# EasyEDA Pro project 外接板20260108.eprj, board PCB2
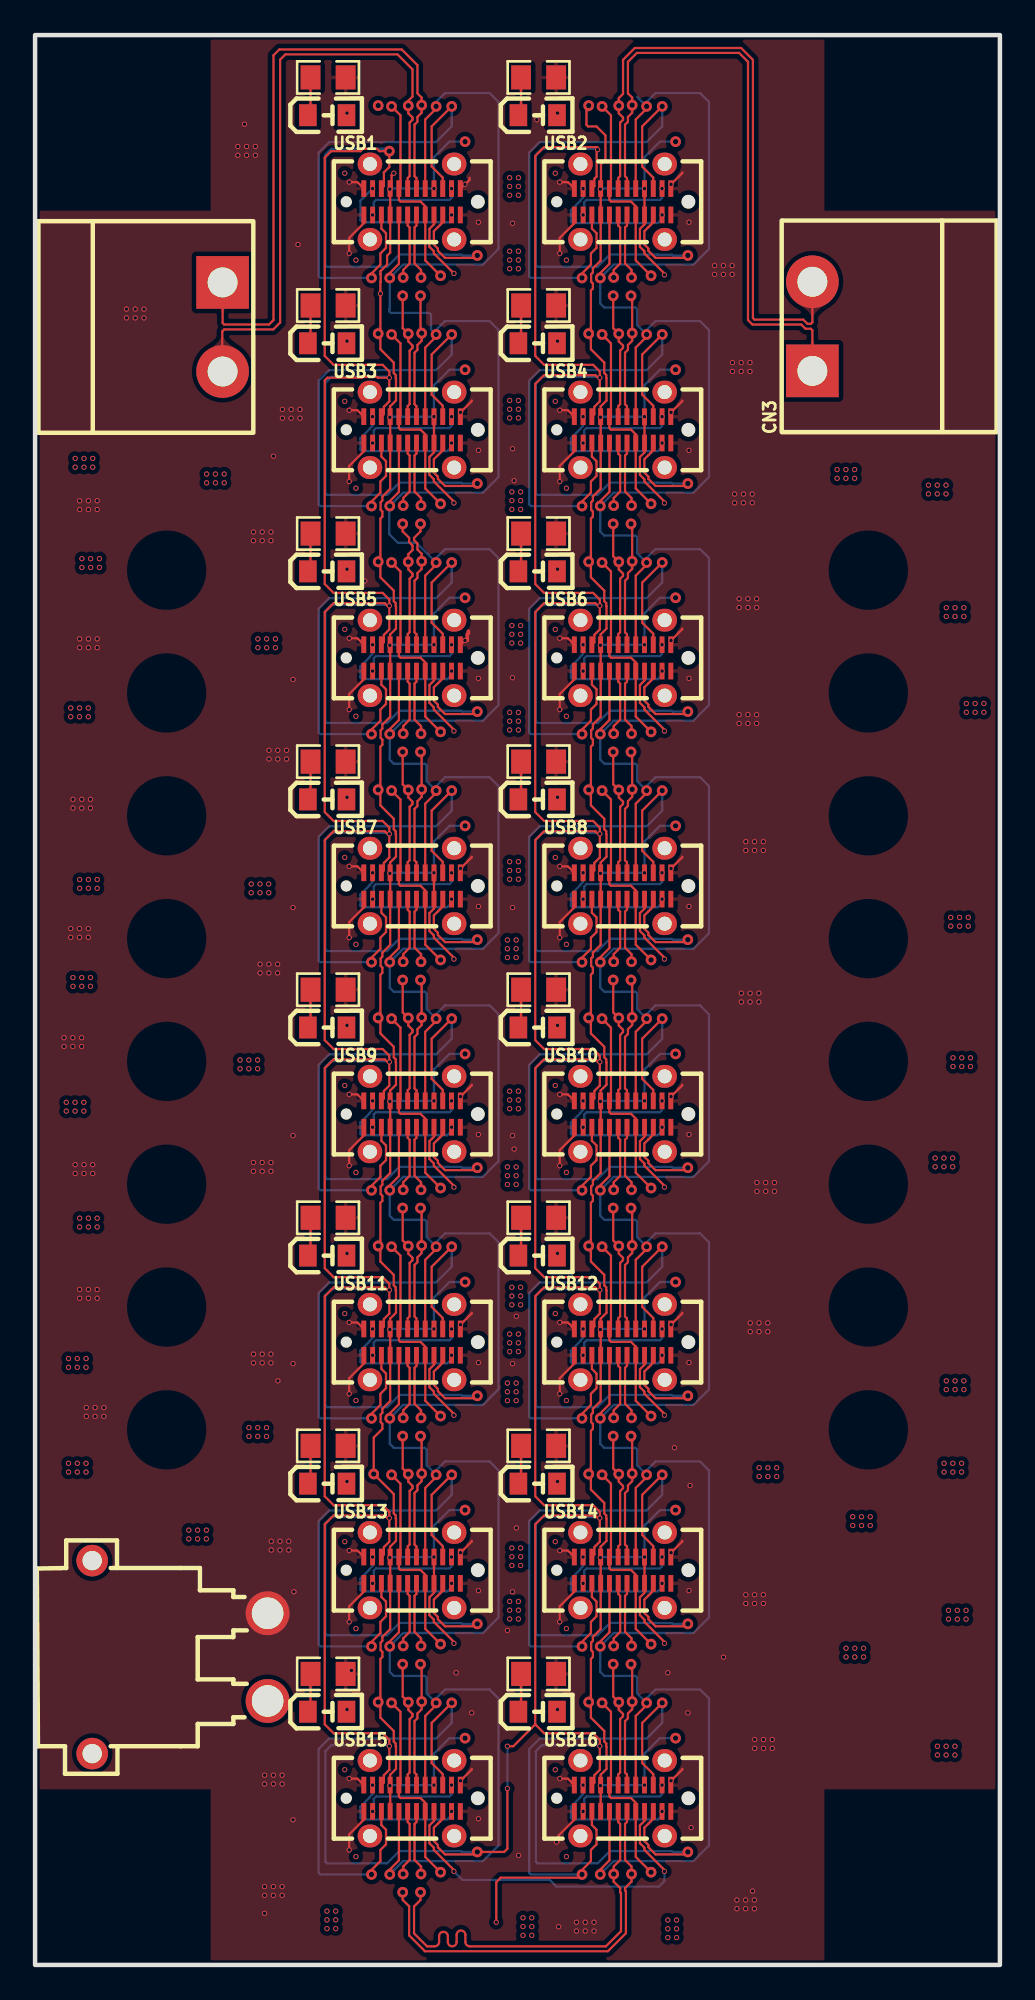
[diagram p1: board, top side]
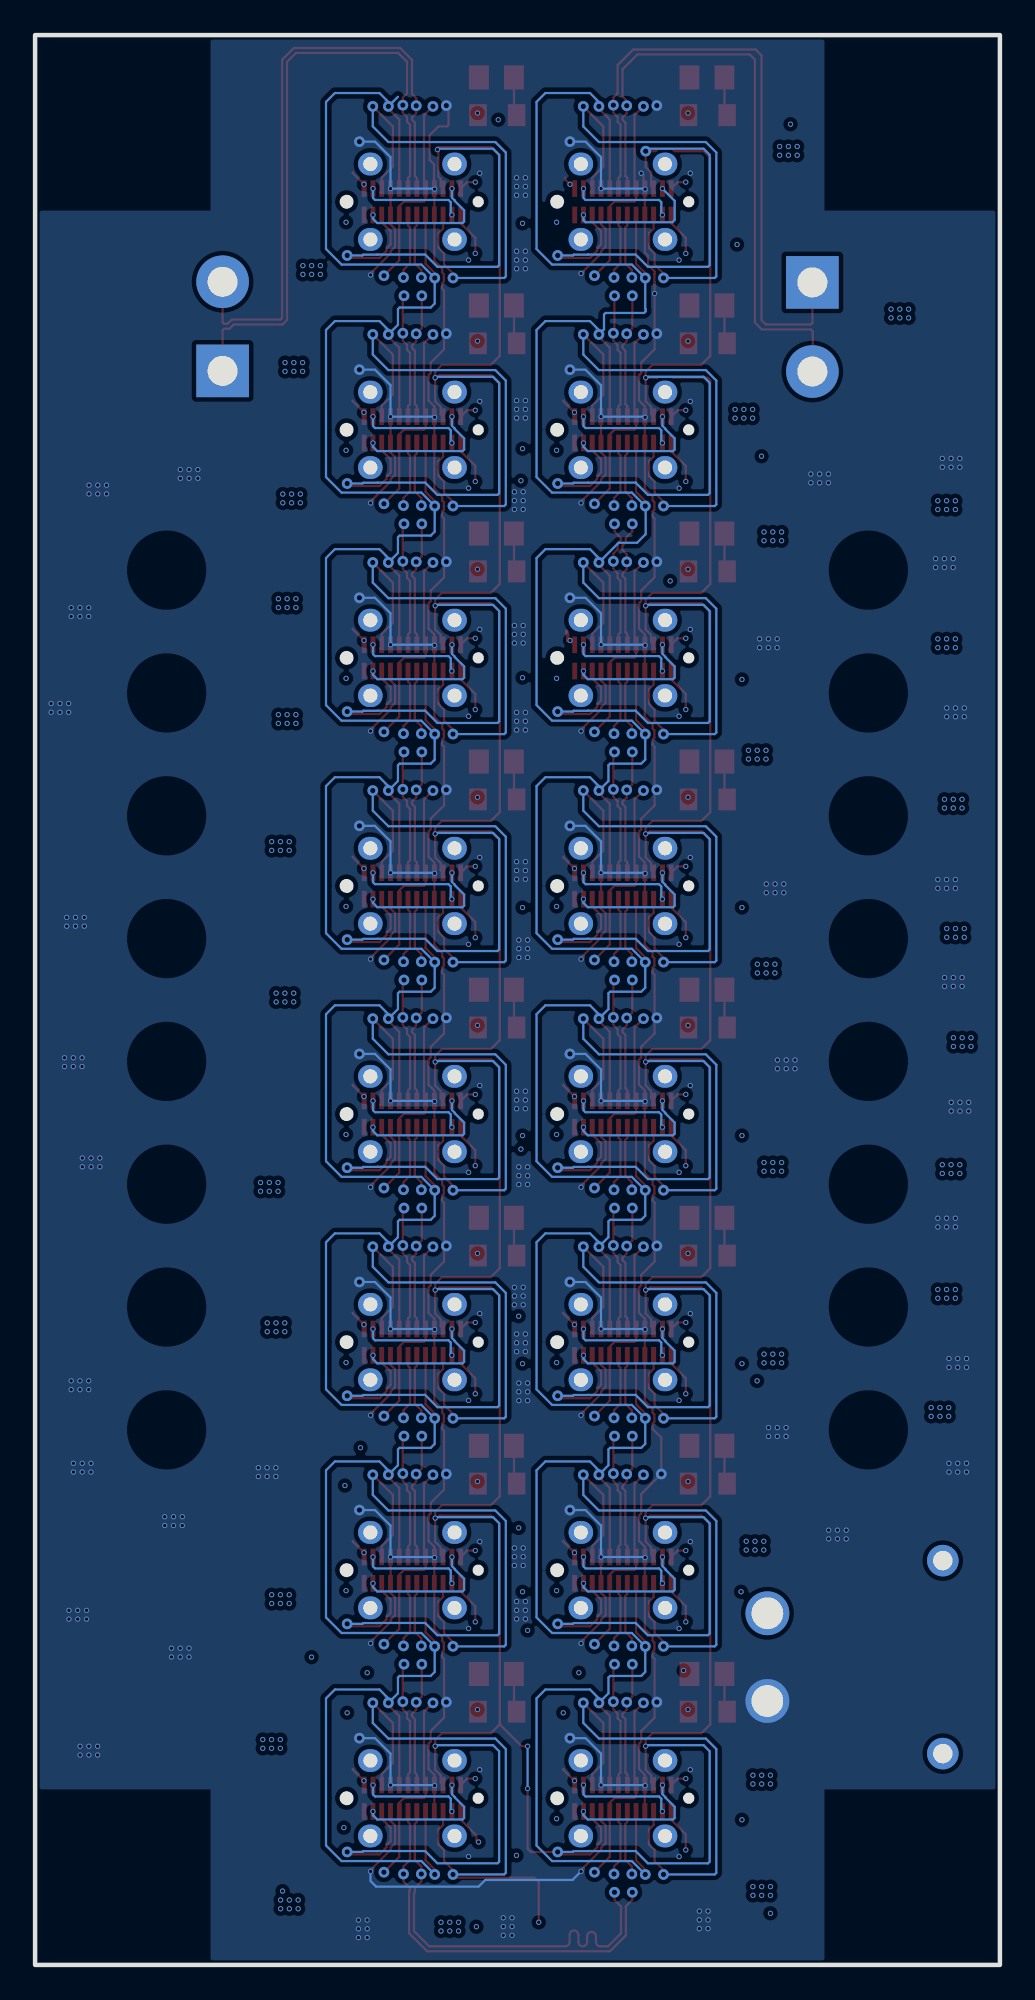
[diagram p2: board, bottom side, seen from below]

Outline 55 x 110 mm; copper layers: Top Layer, Inner1, Inner2, Bottom Layer. Coordinates in mm from the lower left corner of the outline.
Outline path: rectangle 0,110 55,0
Stack: Top Layer 0.035mm 外层铜厚1oz / Dielectric1 0.2104mm 7628 RC49% 8.6mil / Inner1 0.0152mm 内层铜厚 / Dielectric2 1.065mm 1.1mm H/HOZ Copper / Inner2 0.0152mm 内层铜厚 / Dielectric3 0.2104mm 7628 RC49% 8.6mil / Bottom Layer 0.035mm 外层铜厚1oz

## Design rules (mm)
net CAN_H: DP1
net CAN_L: DP1
template: 自定义配置
spacing copperThickness1oz (default): track to track 0.102, other pairs 0.152 to 0.3
spacing copperThickness2oz: track to track 0.203, other pairs 0.152 to 0.3
track width copperThickness1oz (default): min 0.127, default 0.127, max 2.54
track width copperThickness2oz: min 0.203, default 0.254, max 2.54
differential pair differentialPair (default): width min 0.127, default 0.254, max 2.54; gap min 0.152, default 0.152
via viaSize: diameter min 0.5, default 0.61, max 10; hole min 0.3, default 0.305, max 6.3
via viaSize1 (default): diameter min 0.25, default 0.3, max 10; hole min 0.15, default 0.2, max 6.3

## Placement (name value [footprint] x y rotation side)
CN1  XT30PW-M30.G.Y  [CONN-TH_XT30PW-M]  8.25 17.54 270 top
CN2  WJ2EDGRC-5.08-2P  [CONN-TH_2P-P5.08_WJ2EDGRC-5.08-2P]  10.69 93.36 270 top
CN3  WJ2EDGRC-5.08-2P  [CONN-TH_2P-P5.08_WJ2EDGRC-5.08-2P]  44.31 93.4 90 top
LED1  -  [LED_0805]  16.7 105.43 0 top
LED2  -  [LED_0805]  28.7 105.43 0 top
LED3  -  [LED_0805]  16.7 92.43 0 top
LED4  -  [LED_0805]  28.7 92.43 0 top
LED5  -  [LED_0805]  16.7 79.43 0 top
LED6  -  [LED_0805]  28.7 79.43 0 top
LED7  -  [LED_0805]  16.7 66.43 0 top
LED8  -  [LED_0805]  28.7 66.43 0 top
LED9  -  [LED_0805]  16.7 53.43 0 top
LED10  -  [LED_0805]  28.7 53.43 0 top
LED11  -  [LED_0805]  16.7 40.43 0 top
LED12  -  [LED_0805]  28.7 40.43 0 top
LED13  -  [LED_0805]  16.7 27.43 0 top
LED14  -  [LED_0805]  28.7 27.43 0 top
LED15  -  [LED_0805]  16.7 14.43 0 top
LED16  -  [LED_0805]  28.7 14.43 0 top
R1  1K  [R0805]  16.7 107.59 0 top
R2  1K  [R0805]  28.7 107.59 0 top
R3  1K  [R0805]  16.7 94.59 0 top
R4  1K  [R0805]  28.7 94.59 0 top
R5  1K  [R0805]  16.7 81.59 0 top
R6  1K  [R0805]  28.7 81.59 0 top
R7  1K  [R0805]  16.7 68.59 0 top
R8  1K  [R0805]  28.7 68.59 0 top
R9  1K  [R0805]  16.7 55.59 0 top
R10  1K  [R0805]  28.7 55.59 0 top
R11  1K  [R0805]  16.7 42.59 0 top
R12  1K  [R0805]  28.7 42.59 0 top
R13  1K  [R0805]  16.7 29.59 0 top
R14  1K  [R0805]  28.7 29.59 0 top
R15  1K  [R0805]  16.7 16.59 0 top
R16  1K  [R0805]  28.7 16.59 0 top
USB1  MC-236LS-L64  [TYPE-C-USB-SMD_TYPE-C-31-M-06]  21.49 100.5 0 top
USB2  MC-236LS-L64  [TYPE-C-USB-SMD_TYPE-C-31-M-06]  33.49 100.5 0 top
USB3  MC-236LS-L64  [TYPE-C-USB-SMD_TYPE-C-31-M-06]  21.49 87.5 0 top
USB4  MC-236LS-L64  [TYPE-C-USB-SMD_TYPE-C-31-M-06]  33.49 87.5 0 top
USB5  MC-236LS-L64  [TYPE-C-USB-SMD_TYPE-C-31-M-06]  21.49 74.5 0 top
USB6  MC-236LS-L64  [TYPE-C-USB-SMD_TYPE-C-31-M-06]  33.49 74.5 0 top
USB7  MC-236LS-L64  [TYPE-C-USB-SMD_TYPE-C-31-M-06]  21.49 61.5 0 top
USB8  MC-236LS-L64  [TYPE-C-USB-SMD_TYPE-C-31-M-06]  33.49 61.5 0 top
USB9  MC-236LS-L64  [TYPE-C-USB-SMD_TYPE-C-31-M-06]  21.49 48.5 0 top
USB10  MC-236LS-L64  [TYPE-C-USB-SMD_TYPE-C-31-M-06]  33.49 48.5 0 top
USB11  MC-236LS-L64  [TYPE-C-USB-SMD_TYPE-C-31-M-06]  21.49 35.5 0 top
USB12  MC-236LS-L64  [TYPE-C-USB-SMD_TYPE-C-31-M-06]  33.49 35.5 0 top
USB13  MC-236LS-L64  [TYPE-C-USB-SMD_TYPE-C-31-M-06]  21.49 22.5 0 top
USB14  MC-236LS-L64  [TYPE-C-USB-SMD_TYPE-C-31-M-06]  33.49 22.5 0 top
USB15  MC-236LS-L64  [TYPE-C-USB-SMD_TYPE-C-31-M-06]  21.49 9.5 0 top
USB16  MC-236LS-L64  [TYPE-C-USB-SMD_TYPE-C-31-M-06]  33.49 9.5 0 top

## Footprints (pads in the part's own frame, mm; a bottom-side part is the same pattern mirrored in y, then rotated)
CONN-TH_2P-P5.08_WJ2EDGRC-5.08-2P
  rect 3x3 hole 1.7: 1(-2.54,0)
  round 3 hole 1.7: 2(2.54,0)
CONN-TH_XT30PW-M
  round 2.5 hole 1.8: 1(-2.5,5) 2(2.5,5)
  round 1.8 hole 1.1: 3(5.5,-5) 4(-5.5,-5)
LED_0805
  rect 1x1.25 smd: 1(-1.15,0.005) 2(1.05,0.005)
R0805
  rect 1.133x1.377 smd: 1(-1,0) 2(1,0)
TYPE-C-USB-SMD_TYPE-C-31-M-06
  oval 1.4x1.3 hole 0.8: 25(-2.401,2.15) 25(-2.401,-2.15) 25(2.399,2.15) 25(2.399,-2.15)
  rect 0.28x0.95 smd: A1(-2.751,0.75) A2(-2.251,0.75) A3(-1.751,0.75) A4(-1.251,0.75) A5(-0.751,0.75) A6(-0.251,0.75) A7(0.249,0.75) A8(0.749,0.75) A9(1.249,0.75) A10(1.749,0.75) A11(2.249,0.75) A12(2.749,0.75) B1(2.751,-0.751) B2(2.251,-0.751) B3(1.751,-0.751) B4(1.251,-0.751) B5(0.751,-0.751) B6(0.251,-0.751) B7(-0.249,-0.751) B8(-0.749,-0.751) B9(-1.249,-0.751) B10(-1.749,-0.751) B11(-2.249,-0.751) B12(-2.749,-0.751)

## Nets
As in the schematic.

Pads without a net: CN1 3 4; USB1 25; USB2 25; USB3 25; USB4 25; USB5 25; USB6 25; USB7 25; USB8 25; USB9 25; USB10 25; USB11 25; USB12 25; USB13 25; USB14 25; USB15 25; USB16 25

## Via types
v1: diameter 0.3, hole 0.2, Top Layer to Bottom Layer, 754 vias
v2: diameter 0.61, hole 0.305, Top Layer to Bottom Layer, 239 vias

## Routing (per net, layer and track width the routed paths; a pad name or vN(x,y) marks a point on that pad's centre or on a via; arc(x,y) is an arc through that point)
GND: length 185.2
  Top Layer w0.127: v1(17.91,62.62) 18.37,62.62 USB7.A1 ; v1(17.91,45.55) 17.91,46.44 18.74,47.28 USB9.B12 ; USB16.A1 30.37,10.62 v1(29.91,10.62) ; USB4.B12 30.74,86.28 29.91,85.44 v1(29.91,84.55) ; 24.89,37.17 24.89,37.14 v1(24.25,36.5) ; v1(36.25,10.5) 36.89,11.13 36.89,11.17 ; v1(24.25,23.5) 24.89,24.13 24.89,24.17 ; USB12.B12 30.74,34.28 29.91,33.44 v1(29.91,32.55) ; v1(36.25,23.5) 36.89,24.13 36.89,24.17 ; v1(17.91,101.62) 18.37,101.62 USB1.A1 ; USB15.B12 18.74,8.28 17.91,7.44 v1(17.91,6.55) ; 36.89,63.17 36.89,63.14 v1(36.25,62.5) ; 24.89,63.17 24.89,63.14 v1(24.25,62.5) ; 24.89,89.17 24.89,89.14 v1(24.25,88.5) ; v1(24.25,10.5) 24.89,11.13 24.89,11.17 ; v1(29.91,88.62) 30.37,88.62 USB4.A1 ; v1(24.25,49.5) 24.89,50.14 24.89,50.17 ; v1(17.91,49.62) 18.37,49.62 USB9.A1 ; USB6.B12 30.74,73.28 29.91,72.44 v1(29.91,71.55) ; 36.89,37.17 36.89,37.14 v1(36.25,36.5) ; 36.89,76.17 36.89,76.14 v1(36.25,75.5) ; USB3.B12 18.74,86.28 17.91,85.44 v1(17.91,84.55) ; USB10.A1 30.37,49.62 v1(29.91,49.62) ; v1(17.91,10.62) 18.37,10.62 USB15.A1 ; USB5.A12 24.26,75.25 v1(24.51,75.5) ; v1(29.91,101.62) 30.37,101.62 USB2.A1 ; v1(17.91,58.55) 17.91,59.44 18.74,60.28 USB7.B12 ; USB1.B12 18.74,99.28 17.91,98.44 v1(17.91,97.55) ; v1(29.91,75.62) 30.37,75.62 USB6.A1 ; v1(29.91,62.62) 30.37,62.62 USB8.A1 ; USB16.B12 30.74,8.28 29.84,7.38 29.84,7 ; USB12.A1 30.37,36.62 v1(29.91,36.62) ; v1(17.91,88.62) 18.37,88.62 USB3.A1 ; 36.89,89.17 36.89,89.14 v1(36.25,88.5) ; 36.89,50.17 36.89,50.14 v1(36.25,49.5) ; USB2.B12 30.74,99.28 29.91,98.44 v1(29.91,97.55) ; v1(29.91,19.55) 29.91,20.44 30.74,21.28 USB14.B12 ; v1(17.91,36.62) 18.37,36.62 USB11.A1 ; USB14.A1 30.37,23.62 v1(29.91,23.62) ; USB13.B12 18.74,21.28 17.91,20.44 v1(17.91,19.55) ; USB1.A12 24.48,101.5 v1(24.51,101.5) 24.52,101.5 24.76,101.75 24.76,101.87 ; USB11.B12 18.74,34.28 17.91,33.44 v1(17.91,32.55) ; 36.89,102.17 36.89,102.13 v1(36.25,101.5) ; v1(17.91,23.62) 18.37,23.62 USB13.A1 ; USB5.B12 18.74,73.28 17.91,72.44 v1(17.91,71.55) ; v1(29.91,45.55) 29.91,46.44 30.74,47.28 USB10.B12 ; v1(29.91,58.55) 29.91,59.44 30.74,60.28 USB8.B12 ; USB5.A1 18.37,75.62 v1(17.91,75.62)
  Top Layer w0.2: 24.7,76.03 24.7,75.9 24.64,75.84 24.64,75.5 24.63,75.5 v1(24.51,75.5)
  Inner2 w0.127: v1(29.91,58.55) 29.27,58.55 28.76,59.06 28.76,60.34 ; v1(17.91,32.55) 17.27,32.55 16.76,33.06 16.76,34.34 ; 16.76,8.34 16.76,9.47 v1(17.91,10.62) ; 16.76,8.34 16.7,8.27 v1(14.71,8.27) ; 16.76,8.34 16.76,7.06 17.27,6.55 v1(17.91,6.55) ; v1(27.21,86.43) 28.7,86.43 28.76,86.49 ; 28.76,34.34 28.76,35.47 v1(29.91,36.62) ; 28.76,34.34 28.76,33.06 29.27,32.55 v1(29.91,32.55) ; 28.76,34.34 28.7,34.27 v1(27.21,34.27) ; 16.76,98.06 16.76,100.47 v1(17.91,101.62) ; 16.76,98.06 v1(14.99,98.06) ; 16.76,98.06 17.27,97.55 v1(17.91,97.55) ; 28.76,73.44 28.7,73.37 v1(27.21,73.37) ; 16.76,34.34 16.7,34.27 v1(14.71,34.27) ; 16.76,34.34 16.76,35.47 v1(17.91,36.62) ; 16.76,85.99 16.76,87.47 v1(17.91,88.62) ; 16.76,85.99 16.76,85.06 17.27,84.55 v1(17.91,84.55) ; 16.76,85.99 16.75,86 v1(13.59,86) ; v1(17.91,71.55) 17.27,71.55 16.76,72.06 16.76,73.34 ; v1(29.91,23.62) 28.76,22.47 28.76,21.34 ; v1(29.91,88.62) 28.76,87.47 28.76,86.49 ; 16.76,21.29 16.75,21.27 v1(14.76,21.27) ; 16.76,21.29 16.76,22.47 v1(17.91,23.62) ; 16.76,21.29 16.76,20.06 17.27,19.55 v1(17.91,19.55) ; v1(29.91,19.55) 29.27,19.55 28.76,20.06 28.76,21.34 ; 16.76,47.34 16.76,46.06 17.27,45.55 v1(17.91,45.55) ; 16.76,47.34 16.76,48.47 v1(17.91,49.62) ; 16.76,47.34 16.7,47.27 v1(14.71,47.27) ; v1(27.21,60.27) 28.7,60.27 28.76,60.34 ; v1(27.21,47.27) 28.7,47.27 28.76,47.34 ; v1(29.91,75.62) 28.76,74.47 28.76,72.06 29.27,71.55 v1(29.91,71.55) ; v1(17.91,75.62) 16.76,74.47 16.76,73.34 ; v1(29.91,62.62) 28.76,61.47 28.76,60.34 ; 28.76,21.34 28.7,21.27 v1(27.21,21.27) ; 16.76,73.34 16.7,73.27 v1(14.71,73.27) ; v1(29.91,49.62) 28.76,48.47 28.76,46.06 29.27,45.55 v1(29.91,45.55) ; v1(27.21,99.27) 28.7,99.27 28.76,99.34 ; v1(29.91,84.55) 29.27,84.55 28.76,85.06 28.76,86.49 ; v1(17.91,58.55) 17.27,58.55 16.76,59.06 16.76,60.34 ; v1(14.71,60.27) 16.7,60.27 16.76,60.34 ; v1(29.91,97.55) 29.27,97.55 28.76,98.06 28.76,100.47 v1(29.91,101.62) ; 16.76,60.34 16.76,61.47 v1(17.91,62.62) ; v1(29.72,7) 29.66,7.06 28.89,7.06 28.76,7.19 28.76,9.47 v1(29.91,10.62)
  vias: v1(1.65,52.85) v1(1.65,52.35) v1(2.03,59.07) v1(2.03,58.57) v1(2.16,66.44) v1(2.16,65.94) v1(2.15,52.85) v1(2.15,52.35) v1(2.29,45.61) v1(2.29,45.11) v1(2.54,83.46) v1(2.54,82.96) v1(2.54,75.58) v1(2.54,75.08) v1(2.53,59.07) v1(2.53,58.57) v1(2.54,38.5) v1(2.54,38) v1(2.66,66.44) v1(2.66,65.94) v1(2.65,52.85) v1(2.65,52.35) v1(2.79,45.61) v1(2.79,45.11) v1(2.92,31.77) v1(2.92,31.27) v1(3.04,83.46) v1(3.04,82.96) v1(3.04,75.58) v1(3.04,75.08) v1(3.03,59.07) v1(3.03,58.57) v1(3.04,38.5) v1(3.04,38) v1(3.16,66.44) v1(3.16,65.94) v1(3.29,45.61) v1(3.29,45.11) v1(3.42,31.77) v1(3.42,31.27) v1(3.54,83.46) v1(3.54,82.96) v1(3.54,75.58) v1(3.54,75.08) v1(3.54,38.5) v1(3.54,38) v1(3.92,31.77) v1(3.92,31.27) v1(5.21,94.38) v1(5.21,93.88) v1(5.71,94.38) v1(5.71,93.88) v1(6.21,94.38) v1(6.21,93.88) v1(11.56,103.65) v1(11.56,103.15) v1(11.94,104.92) v1(12.06,103.65) v1(12.06,103.15) v1(12.45,81.68) v1(12.45,81.18) v1(12.45,45.74) v1(12.45,45.24) v1(12.45,34.82) v1(12.45,34.32) v1(12.56,103.65) v1(12.56,103.15) v1(12.83,57.04) v1(12.83,56.54) v1(12.95,81.68) v1(12.95,81.18) v1(12.95,45.74) v1(12.95,45.24) v1(12.95,34.82) v1(12.95,34.32) v1(13.08,10.81) v1(13.08,10.31) v1(13.08,4.46) v1(13.08,3.96) v1(13.08,2.94) v1(13.34,69.23) v1(13.34,68.73) v1(13.33,57.04) v1(13.33,56.54) v1(13.45,81.68) v1(13.45,81.18) v1(13.45,45.74) v1(13.45,45.24) v1(13.45,34.82) v1(13.45,34.32) v1(13.46,24.15) v1(13.46,23.65) v1(13.58,10.81) v1(13.58,10.31) v1(13.58,4.46) v1(13.58,3.96) v1(13.84,69.23) v1(13.84,68.73) v1(13.83,57.04) v1(13.83,56.54) v1(13.84,33.29) v1(13.96,24.15) v1(13.96,23.65) v1(14.1,88.66) v1(14.1,88.16) v1(14.08,10.81) v1(14.08,10.31) v1(14.08,4.46) v1(14.08,3.96) v1(14.34,69.23) v1(14.34,68.73) v1(14.46,24.15) v1(14.46,23.65) v1(14.6,88.66) v1(14.6,88.16) v1(15.1,88.66) v1(15.1,88.16) v1(18.03,16.78) v1(18.8,78.89) v1(24,16.66) v1(24.89,14.37) v1(25.27,99.33) v1(25.27,86.33) v1(25.27,73.33) v1(25.27,60.33) v1(25.27,47.33) v1(25.27,34.33) v1(25.27,21.33) v1(25.27,8.33) v1(26.92,19.07) v1(27.31,84.6) v1(27.31,46.5) v1(27.43,36.97) v1(27.43,24.91) v1(27.56,6.24) v1(28.6,105.17) v1(29.84,2.18) v1(30.86,2.43) v1(30.86,1.93) v1(31.36,2.43) v1(31.36,1.93) v1(31.86,2.43) v1(31.86,1.93) v1(36.07,16.66) v1(36.45,29.48) v1(37.21,14.37) v1(37.27,99.33) v1(37.27,86.33) v1(37.27,73.33) v1(37.27,60.33) v1(37.27,47.33) v1(37.27,34.33) v1(37.34,27.32) v1(37.27,21.33) v1(37.4,7.82) v1(38.74,96.86) v1(38.74,96.36) v1(39.24,96.86) v1(39.24,96.36) v1(39.24,17.54) v1(39.74,96.86) v1(39.74,96.36) v1(39.75,91.33) v1(39.75,90.83) v1(39.88,83.84) v1(39.88,83.34) v1(40,3.7) v1(40,3.2) v1(40.13,77.87) v1(40.13,77.37) v1(40.13,71.27) v1(40.13,70.77) v1(40.25,91.33) v1(40.25,90.83) v1(40.26,55.39) v1(40.26,54.89) v1(40.38,83.84) v1(40.38,83.34) v1(40.51,64.03) v1(40.51,63.53) v1(40.51,21.1) v1(40.51,20.6) v1(40.5,3.7) v1(40.5,3.2) v1(40.63,77.87) v1(40.63,77.37) v1(40.63,71.27) v1(40.63,70.77) v1(40.75,91.33) v1(40.75,90.83) v1(40.76,55.39) v1(40.76,54.89) v1(40.77,36.59) v1(40.77,36.09) v1(40.88,83.84) v1(40.88,83.34) v1(40.89,4.21) v1(41.01,64.03) v1(41.01,63.53) v1(41.01,21.1) v1(41.01,20.6) v1(41.02,12.84) v1(41.02,12.34) v1(41,3.7) v1(41,3.2) v1(41.13,77.87) v1(41.13,77.37) v1(41.13,71.27) v1(41.13,70.77) v1(41.15,44.59) v1(41.15,44.09) v1(41.26,55.39) v1(41.26,54.89) v1(41.27,36.59) v1(41.27,36.09) v1(41.51,64.03) v1(41.51,63.53) v1(41.51,21.1) v1(41.51,20.6) v1(41.52,12.84) v1(41.52,12.34) v1(41.65,44.59) v1(41.65,44.09) v1(41.77,36.59) v1(41.77,36.09) v1(42.02,12.84) v1(42.02,12.34) v1(42.15,44.59) v1(42.15,44.09)
VCC3_3V: length 581.9
  Top Layer w0.127: v2(19.18,83.16) 19.18,83.41 19.69,83.92 19.69,84.55 20,84.87 20,85.71 19.74,85.97 USB3.B10 ; v2(31.18,96.16) 31.18,96.41 31.69,96.92 31.69,97.55 32,97.87 32,98.71 31.74,98.97 USB2.B10 ; v2(35.75,14.94) 34.61,13.79 34.61,11.51 35.24,10.87 USB16.A10 ; USB12.B10 31.74,33.97 32,33.71 32,32.87 31.69,32.55 31.69,31.92 31.18,31.41 v2(31.18,31.16) ; USB7.B10 19.74,59.97 20,59.71 20,58.87 19.69,58.55 19.69,57.92 19.18,57.41 v2(19.18,57.16) ; v2(19.18,31.16) 19.18,31.41 19.69,31.92 19.69,32.55 20,32.87 20,33.71 19.74,33.97 USB11.B10 ; v2(19.18,5.16) 19.18,5.41 19.69,5.92 19.69,6.55 20,6.87 20,7.71 19.74,7.97 USB15.B10 ; USB1.A10 23.24,101.87 22.61,102.51 22.61,104.79 v2(23.75,105.94) ; USB13.B10 19.74,20.97 20,20.71 20,19.87 19.69,19.55 19.69,18.92 19.18,18.41 v2(19.18,18.16) ; v2(23.75,40.94) 22.61,39.79 22.61,37.51 23.24,36.87 USB11.A10 ; v2(35.75,53.94) 34.61,52.79 34.61,50.51 35.24,49.87 USB10.A10 ; v2(23.75,66.94) 22.61,65.79 22.61,63.51 23.24,62.87 USB7.A10 ; v2(35.75,92.94) 34.61,91.79 34.61,89.51 35.24,88.87 USB4.A10 ; USB5.B10 19.74,72.97 20,72.71 20,71.87 19.69,71.55 19.69,70.92 19.18,70.41 v2(19.18,70.16) ; USB3.A10 23.24,88.87 22.61,89.51 22.61,91.79 v2(23.75,92.94) ; USB14.B10 31.74,20.97 32,20.71 32,19.87 31.69,19.55 31.69,18.92 31.18,18.41 v2(31.18,18.16) ; USB4.B10 31.74,85.97 32,85.71 32,84.87 31.69,84.55 31.69,83.92 31.18,83.41 v2(31.18,83.16) ; USB15.A10 23.24,10.87 22.61,11.51 22.61,13.79 v2(23.75,14.94) ; USB2.A10 35.24,101.87 34.61,102.51 34.61,104.79 v2(35.75,105.94) ; v2(23.75,53.94) 22.61,52.79 22.61,50.51 23.24,49.87 USB9.A10 ; v2(31.18,70.16) 31.18,70.41 31.69,70.92 31.69,71.55 32,71.87 32,72.71 31.74,72.97 USB6.B10 ; USB5.A10 23.24,75.87 22.61,76.51 22.61,78.79 v2(23.75,79.94) ; USB1.B10 19.74,98.97 20,98.71 20,97.87 19.69,97.55 19.69,96.92 19.18,96.41 v2(19.18,96.16) ; v2(31.18,57.16) 31.18,57.41 31.69,57.92 31.69,58.55 32,58.87 32,59.71 31.74,59.97 USB8.B10 ; USB16.B10 31.74,7.97 32,7.71 32,6.87 31.69,6.55 31.69,5.92 31.18,5.41 v2(31.18,5.16) 30.99,4.97 26.54,4.97 26.29,4.72 v1(26.29,2.43) ; USB12.A10 35.24,36.87 34.61,37.51 34.61,39.79 v2(35.75,40.94) ; USB14.A10 35.24,23.87 34.61,24.51 34.61,26.79 v2(35.75,27.94) ; USB8.A10 35.24,62.87 34.61,63.51 34.61,65.79 v2(35.75,66.94) ; USB10.B10 31.74,46.97 32,46.71 32,45.87 31.69,45.55 31.69,44.92 31.18,44.41 v2(31.18,44.16) ; USB9.B10 19.74,46.97 20,46.71 20,45.87 19.69,45.55 19.69,44.92 19.18,44.41 v2(19.18,44.16) ; USB13.A10 23.24,23.87 22.61,24.51 22.61,26.79 v2(23.75,27.94) ; USB6.A10 35.24,75.87 34.61,76.51 34.61,78.79 v2(35.75,79.94)
  Inner1 w0.127: v1(26.29,2.43) 19.69,2.43 19.18,2.94 v2(19.18,5.16) ; v2(31.18,31.16) 31.18,29.47 31.43,29.22 35.24,29.22 35.75,28.71 v2(35.75,27.94) ; v2(31.18,18.16) 31.18,16.47 31.43,16.22 35.24,16.22 35.75,15.71 v2(35.75,14.94) ; v2(19.18,96.16) 19.18,94.51 19.56,94.12 22.73,94.12 23.75,93.11 v2(23.75,92.94) ; v2(35.75,92.94) 35.75,93.71 35.24,94.22 31.43,94.22 31.18,94.47 v2(31.18,96.16) ; v2(35.75,79.94) 35.75,80.71 35.24,81.22 31.43,81.22 31.18,81.47 v2(31.18,83.16) ; v2(19.18,70.16) 19.18,68.47 19.43,68.22 23.24,68.22 23.75,67.71 v2(23.75,66.94) ; v2(23.75,27.94) 23.75,28.71 23.24,29.22 19.43,29.22 19.18,29.47 v2(19.18,31.16) ; v2(35.75,66.94) 35.75,67.71 35.24,68.22 31.43,68.22 31.18,68.47 v2(31.18,70.16) ; v2(19.18,44.16) 19.18,42.47 19.43,42.22 23.24,42.22 23.75,41.71 v2(23.75,40.94) ; v2(23.75,53.94) 23.75,54.71 23.24,55.22 19.43,55.22 19.18,55.47 v2(19.18,57.16) ; v2(35.75,53.94) 35.75,54.71 35.24,55.22 31.43,55.22 31.18,55.47 v2(31.18,57.16) ; v2(23.75,79.94) 23.46,80.23 23.46,81.08 23.37,81.17 19.69,81.17 19.18,81.68 v2(19.18,83.16) ; v2(35.75,40.94) 35.75,41.71 35.24,42.22 31.43,42.22 31.18,42.47 v2(31.18,44.16) ; v2(19.18,18.16) 19.18,16.47 19.43,16.22 23.24,16.22 23.75,15.71 v2(23.75,14.94)
  Bottom Layer w0.127: v2(19.18,18.16) 16.26,18.16 16.17,18.25 16.17,25.31 16.76,25.9 22.86,25.9 23.75,26.79 v2(23.75,27.94) ; v2(19.18,31.16) 16.26,31.16 16.17,31.25 16.17,38.31 16.76,38.9 22.86,38.9 23.75,39.79 v2(23.75,40.94) ; v2(35.75,79.94) 35.75,78.79 34.86,77.9 28.76,77.9 28.17,77.31 28.17,70.25 28.26,70.16 v2(31.18,70.16) ; v2(31.18,5.16) 28.26,5.16 28.17,5.25 28.17,12.31 28.76,12.9 34.86,12.9 35.75,13.79 v2(35.75,14.94) ; v2(35.75,27.94) 35.75,26.79 34.86,25.9 28.76,25.9 28.17,25.31 28.17,18.25 28.26,18.16 v2(31.18,18.16) ; v2(19.18,5.16) 16.26,5.16 16.17,5.25 16.17,12.31 16.76,12.9 22.86,12.9 23.75,13.79 v2(23.75,14.94) ; v2(35.75,66.94) 35.75,65.79 34.86,64.9 28.76,64.9 28.17,64.31 28.17,57.25 28.26,57.16 v2(31.18,57.16) ; v2(31.18,83.16) 28.26,83.16 28.17,83.25 28.17,90.31 28.76,90.9 34.86,90.9 35.75,91.79 v2(35.75,92.94) ; v2(35.75,105.94) 35.75,104.79 34.86,103.9 28.76,103.9 28.17,103.31 28.17,96.25 28.26,96.16 v2(31.18,96.16) ; v2(23.75,105.94) 23.75,104.79 22.86,103.9 16.76,103.9 16.17,103.31 16.17,96.25 16.26,96.16 v2(19.18,96.16) ; v2(35.75,53.94) 35.75,52.79 34.86,51.9 28.76,51.9 28.17,51.31 28.17,44.25 28.26,44.16 v2(31.18,44.16) ; v2(23.75,66.94) 23.75,65.79 22.86,64.9 16.76,64.9 16.17,64.31 16.17,57.25 16.26,57.16 v2(19.18,57.16) ; v2(19.18,44.16) 16.26,44.16 16.17,44.25 16.17,51.31 16.76,51.9 22.86,51.9 23.75,52.79 v2(23.75,53.94) ; v2(23.75,79.94) 23.75,78.79 22.86,77.9 16.76,77.9 16.17,77.31 16.17,70.25 16.26,70.16 v2(19.18,70.16) ; v2(19.18,83.16) 16.26,83.16 16.17,83.25 16.17,90.31 16.76,90.9 22.86,90.9 23.75,91.79 v2(23.75,92.94) ; v2(31.18,31.16) 28.26,31.16 28.17,31.25 28.17,38.31 28.76,38.9 34.86,38.9 35.75,39.79 v2(35.75,40.94)
VIN: length 632.6
  Top Layer w0.127: v1(23.88,96.41) 22.73,97.55 22.73,97.68 22.48,97.94 22.48,98.95 22.74,99.21 USB1.B4 ; USB5.B4 22.74,73.21 22.48,72.95 22.48,71.94 22.73,71.68 22.73,71.55 23.88,70.41 ; v1(34.74,88.25) 34.74,86.75 ; v1(34.74,23.25) 34.74,21.75 ; 23.88,18.41 22.73,19.55 22.73,19.68 22.48,19.94 22.48,20.95 22.74,21.21 USB13.B4 ; 35.88,96.41 34.73,97.55 34.73,97.68 34.48,97.94 34.48,98.95 34.74,99.21 USB2.B4 ; USB9.B4 22.74,47.21 22.48,46.95 22.48,45.94 22.73,45.68 22.73,45.55 23.88,44.41 ; 35.88,18.41 34.73,19.55 34.73,19.68 34.48,19.94 34.48,20.95 34.74,21.21 USB14.B4 ; v1(22.74,88.25) 22.74,86.75 ; 23.88,83.41 22.73,84.55 22.73,84.68 22.48,84.94 22.48,85.95 22.74,86.21 USB3.B4 ; 35.88,70.41 34.73,71.55 34.73,71.68 34.48,71.94 34.48,72.95 34.74,73.21 USB6.B4 ; USB12.B4 34.74,34.21 34.48,33.95 34.48,32.94 34.73,32.68 34.73,32.55 35.88,31.41 ; USB15.B9 20.24,10.25 USB15.A4 20.24,10.84 20.57,11.17 20.57,12.44 20.56,12.46 20.56,12.62 20.45,12.73 20.45,13.33 19.69,14.09 19.69,17.44 19.8,17.55 19.8,17.84 19.7,17.94 19.7,18.37 19.8,18.47 19.8,18.7 20.24,19.14 USB13.B9 20.24,23.25 USB13.A4 20.24,23.84 20.57,24.17 20.57,25.44 20.56,25.46 20.56,25.62 20.45,25.73 20.45,26.84 v2(19.3,27.98) 19.3,30.06 19.8,30.55 19.8,30.84 19.7,30.94 19.7,31.37 19.8,31.47 19.8,31.7 20.24,32.14 USB11.B9 20.24,36.25 USB11.A4 20.24,36.84 20.57,37.17 20.57,38.44 20.56,38.46 20.56,38.62 20.45,38.73 20.45,39.33 19.69,40.09 19.69,43.44 19.8,43.55 19.8,43.84 19.7,43.94 19.7,44.37 19.8,44.47 19.8,44.7 20.24,45.14 USB9.B9 20.24,49.25 USB9.A4 20.24,49.84 20.57,50.17 20.57,51.44 20.56,51.46 20.56,51.62 20.45,51.73 20.45,52.33 19.69,53.09 19.69,56.44 19.8,56.55 19.8,56.84 19.7,56.94 19.7,57.37 19.8,57.47 19.8,57.7 20.24,58.14 USB7.B9 20.24,62.25 USB7.A4 20.24,62.84 20.57,63.17 20.57,64.44 20.56,64.46 20.56,64.62 20.45,64.73 20.45,65.33 19.69,66.09 19.69,69.44 19.8,69.55 19.8,69.84 19.7,69.94 19.7,70.37 19.8,70.47 19.8,70.7 20.24,71.14 USB5.B9 20.24,75.25 USB5.A4 20.24,75.84 20.57,76.17 20.57,77.44 20.56,77.46 20.56,77.62 20.45,77.73 20.45,78.33 19.69,79.09 19.69,82.44 19.8,82.55 19.8,82.84 19.7,82.94 19.7,83.37 19.8,83.47 19.8,83.7 20.24,84.14 USB3.B9 20.24,88.25 USB3.A4 20.24,88.84 20.57,89.17 20.57,90.44 20.56,90.46 20.56,90.62 20.45,90.73 20.45,91.33 19.69,92.09 v1(19.69,95.27) 19.69,95.93 19.7,95.94 19.7,96.37 19.69,96.38 19.69,96.54 20.07,96.92 20.07,97.43 20.24,97.6 USB1.B9 20.24,101.25 USB1.A4 20.32,101.33 20.32,102 v1(20.45,102.13) ; v1(22.74,62.25) 22.74,60.75 ; 23.88,5.41 22.73,6.55 22.73,6.68 22.48,6.94 22.48,7.95 22.74,8.21 USB15.B4 ; v1(22.74,23.25) 22.74,21.75 ; 23.88,31.41 22.73,32.55 22.73,32.68 22.48,32.94 22.48,33.95 22.74,34.21 USB11.B4 ; 35.88,44.41 34.73,45.55 34.73,45.68 34.48,45.94 34.48,46.95 34.74,47.21 USB10.B4 ; v2(31.56,105.98) 31.43,105.85 31.43,104.88 31.52,104.79 32,104.79 32.51,104.28 32.51,102.89 32.26,102.63 32.26,101.27 USB2.A4 32.24,101.25 USB2.B9 32.24,97.14 31.8,96.7 31.8,96.47 31.7,96.37 31.7,95.94 31.8,95.84 31.8,95.55 31.69,95.44 31.69,92.09 32.45,91.33 32.45,90.73 32.56,90.62 32.56,90.46 32.57,90.44 32.57,89.17 32.24,88.84 USB4.A4 32.24,88.25 USB4.B9 32.24,84.14 31.8,83.7 31.8,83.47 31.7,83.37 31.7,82.94 31.8,82.84 31.8,82.55 31.69,82.44 31.69,79.09 32.45,78.33 32.45,77.73 32.56,77.62 32.56,77.46 32.57,77.44 32.57,76.17 32.24,75.84 USB6.A4 32.24,75.25 USB6.B9 32.24,71.14 31.8,70.7 31.8,70.47 31.7,70.37 31.7,69.94 31.8,69.84 31.8,69.55 31.69,69.44 31.69,66.09 32.45,65.33 32.45,64.73 32.56,64.62 32.56,64.46 32.57,64.44 32.57,63.17 32.24,62.84 USB8.A4 32.24,62.25 USB8.B9 32.24,58.14 31.8,57.7 31.8,57.47 31.7,57.37 31.7,56.94 31.8,56.84 31.8,56.55 31.69,56.44 31.69,53.09 32.45,52.33 32.45,51.73 32.56,51.62 32.56,51.46 32.57,51.44 32.57,50.17 32.24,49.84 USB10.A4 32.24,49.25 USB10.B9 32.24,45.14 31.8,44.7 31.8,44.47 31.7,44.37 31.7,43.94 31.8,43.84 31.8,43.55 31.69,43.44 31.69,40.09 32.45,39.33 32.45,38.73 32.56,38.62 32.56,38.46 32.57,38.44 32.57,37.17 32.24,36.84 USB12.A4 32.24,36.25 USB12.B9 32.24,32.14 31.8,31.7 31.8,31.47 31.7,31.37 31.7,30.94 31.8,30.84 31.8,30.55 31.69,30.44 31.69,27.09 32.45,26.33 32.45,25.73 32.56,25.62 32.56,25.46 32.57,25.44 32.57,24.17 32.24,23.84 USB14.A4 32.24,23.25 USB14.B9 32.24,19.14 31.8,18.7 31.8,18.47 31.7,18.37 31.7,17.94 31.8,17.84 31.8,17.55 31.69,17.44 31.69,14.09 32.45,13.33 32.45,12.73 32.56,12.62 32.56,12.46 32.57,12.44 32.57,11.17 32.24,10.84 USB16.A4 32.24,10.25 USB16.B9 ; 23.88,57.41 22.73,58.55 22.73,58.68 22.48,58.94 22.48,59.95 22.74,60.21 USB7.B4 ; v1(34.74,101.25) 34.74,99.75 ; USB8.B4 34.74,60.21 34.48,59.95 34.48,58.94 34.73,58.68 34.73,58.55 35.88,57.41 ; 35.88,5.41 34.73,6.55 34.73,6.68 34.48,6.94 34.48,7.95 34.74,8.21 USB16.B4 ; USB4.B4 34.74,86.21 34.48,85.95 34.48,84.94 34.73,84.68 34.73,84.55 35.88,83.41
  Inner1 w0.127: v1(35.88,5.33) 37.78,5.33 37.87,5.42 37.87,10.61 38.17,10.91 38.17,11.34 38.12,11.39 38.12,16.89 38.03,16.98 36.64,16.98 35.88,17.74 v1(35.88,18.33) 37.78,18.33 37.87,18.42 37.87,23.61 38.17,23.91 38.17,24.34 38.12,24.39 38.12,29.89 38.03,29.98 36.64,29.98 35.88,30.74 v1(35.88,31.33) 37.78,31.33 37.87,31.42 37.87,36.61 38.17,36.91 38.17,37.34 38.12,37.39 38.12,42.89 38.03,42.98 36.64,42.98 35.88,43.74 v1(35.88,44.33) 37.78,44.33 37.87,44.42 37.87,49.61 38.17,49.91 38.17,50.34 38.12,50.39 38.12,55.89 38.03,55.98 36.64,55.98 35.88,56.74 v1(35.88,57.33) 37.78,57.33 37.87,57.42 37.87,62.61 38.17,62.91 38.17,63.34 38.12,63.39 38.12,68.89 38.03,68.98 36.64,68.98 35.88,69.74 v1(35.88,70.33) 37.78,70.33 37.87,70.42 37.87,75.61 38.17,75.91 38.17,76.34 38.12,76.39 38.12,81.89 38.03,81.98 36.64,81.98 35.88,82.74 v1(35.88,83.33) 37.78,83.33 37.87,83.42 37.87,88.61 38.17,88.91 38.17,89.34 38.12,89.39 38.12,94.89 38.03,94.98 36.64,94.98 35.88,95.74 v1(35.88,96.33) ; v1(23.88,5.33) 25.78,5.33 25.87,5.42 25.87,10.61 26.17,10.91 26.17,11.34 26.12,11.39 26.12,16.69 25.84,16.98 24.64,16.98 23.88,17.74 v1(23.88,18.33) 25.78,18.33 25.87,18.42 25.87,23.61 26.17,23.91 26.17,24.34 26.12,24.39 26.12,29.77 25.92,29.98 24.64,29.98 23.88,30.74 v1(23.88,31.33) 25.78,31.33 25.87,31.42 25.87,36.61 26.17,36.91 26.17,37.34 26.12,37.39 26.12,42.89 26.03,42.98 24.64,42.98 23.88,43.74 v1(23.88,44.33) 25.78,44.33 25.87,44.42 25.87,49.61 26.17,49.91 26.17,50.34 26.12,50.39 26.12,55.89 26.03,55.98 24.64,55.98 23.88,56.74 v1(23.88,57.33) 25.78,57.33 25.87,57.42 25.87,62.61 26.17,62.91 26.17,63.34 26.12,63.39 26.12,68.89 26.03,68.98 24.64,68.98 23.88,69.74 v1(23.88,70.33) 25.78,70.33 25.87,70.42 25.87,75.61 26.17,75.91 26.17,76.34 25.79,76.73 25.53,76.73 24.89,77.36 24.89,81.04 23.88,82.06 v1(23.88,83.33) 25.78,83.33 25.87,83.42 25.87,88.61 26.17,88.91 26.17,89.34 25.87,89.65 25.87,94.92 25.44,95.36 24.93,95.36 v1(23.88,96.41)
  Inner2 w0.127: v1(20.45,102.13) 20.96,102.63 20.96,104.16 20.07,105.05 19.81,105.05 19.56,105.3 v2(19.56,105.98)
  Bottom Layer w0.127: 20.19,101.25 v1(22.74,101.25) 22.74,103.04 23.62,103.93 v2(24.51,103.93) ; v2(36.51,103.93) 35.62,103.93 34.74,103.04 v1(34.74,101.25) 32.19,101.25 ; v2(36.51,51.93) 35.62,51.93 34.74,51.04 v1(34.74,49.25) 32.19,49.25 ; v2(24.51,77.93) 23.62,77.93 22.74,77.04 v1(22.74,75.25) 20.19,75.25 ; v2(24.51,51.93) 23.62,51.93 22.74,51.04 v1(22.74,49.25) 20.19,49.25 ; v2(36.51,64.93) 35.62,64.93 34.74,64.04 v1(34.74,62.25) 32.19,62.25 ; v2(36.51,12.93) 35.62,12.93 34.74,12.04 v1(34.74,10.25) 32.19,10.25 ; v1(23.88,5.33) 24.36,4.84 29.34,4.84 29.72,4.46 35.56,4.46 35.88,4.78 v1(35.88,5.33) ; v2(24.51,12.93) 23.62,12.93 22.74,12.04 v1(22.74,10.25) 20.19,10.25 ; 20.19,23.25 v1(22.74,23.25) 22.74,25.04 23.62,25.93 v2(24.51,25.93) ; 20.19,88.25 v1(22.74,88.25) 22.74,90.04 23.62,90.93 v2(24.51,90.93) ; v2(36.51,25.93) 35.62,25.93 34.74,25.04 v1(34.74,23.25) 32.19,23.25 ; v2(36.51,38.93) 35.62,38.93 34.74,38.04 v1(34.74,36.25) 32.19,36.25 ; 20.19,36.25 v1(22.74,36.25) 22.74,38.04 23.62,38.93 v2(24.51,38.93) ; v2(36.51,90.93) 35.62,90.93 34.74,90.04 v1(34.74,88.25) 32.19,88.25 ; 20.19,62.25 v1(22.74,62.25) 22.74,64.04 23.62,64.93 v2(24.51,64.93) ; 32.19,75.25 v1(34.74,75.25) 34.74,77.04 35.62,77.93 v2(36.51,77.93)
  vias: v1(1.78,49.17) v1(1.78,48.67) v1(1.91,34.56) v1(1.91,34.06) v1(1.91,28.59) v1(1.91,28.09) v1(2.03,71.65) v1(2.03,71.15) v1(2.16,56.28) v1(2.16,55.78) v1(2.29,85.87) v1(2.29,85.37) v1(2.28,49.17) v1(2.28,48.67) v1(2.41,34.56) v1(2.41,34.06) v1(2.41,28.59) v1(2.41,28.09) v1(2.53,71.65) v1(2.53,71.15) v1(2.54,61.87) v1(2.54,61.37) v1(2.54,42.56) v1(2.54,42.06) v1(2.67,80.16) v1(2.67,79.66) v1(2.66,56.28) v1(2.66,55.78) v1(2.79,85.87) v1(2.79,85.37) v1(2.78,49.17) v1(2.78,48.67) v1(2.91,34.56) v1(2.91,34.06) v1(2.91,28.59) v1(2.91,28.09) v1(3.03,71.65) v1(3.03,71.15) v1(3.04,61.87) v1(3.04,61.37) v1(3.04,42.56) v1(3.04,42.06) v1(3.17,80.16) v1(3.17,79.66) v1(3.16,56.28) v1(3.16,55.78) v1(3.29,85.87) v1(3.29,85.37) v1(3.54,61.87) v1(3.54,61.37) v1(3.54,42.56) v1(3.54,42.06) v1(3.67,80.16) v1(3.67,79.66) v1(8.76,24.78) v1(8.76,24.28) v1(9.26,24.78) v1(9.26,24.28) v1(9.78,84.98) v1(9.78,84.48) v1(9.76,24.78) v1(9.76,24.28) v1(10.28,84.98) v1(10.28,84.48) v1(10.78,84.98) v1(10.78,84.48) v1(11.68,51.58) v1(11.68,51.08) v1(12.18,51.58) v1(12.18,51.08) v1(12.19,30.62) v1(12.19,30.12) v1(12.32,61.61) v1(12.32,61.11) v1(12.7,75.58) v1(12.7,75.08) v1(12.68,51.58) v1(12.68,51.08) v1(12.69,30.62) v1(12.69,30.12) v1(12.82,61.61) v1(12.82,61.11) v1(13.2,75.58) v1(13.2,75.08) v1(13.19,30.62) v1(13.19,30.12) v1(13.32,61.61) v1(13.32,61.11) v1(13.7,75.58) v1(13.7,75.08) v1(16.64,3.07) v1(16.64,2.57) v1(16.64,2.07) v1(17.14,3.07) v1(17.14,2.57) v1(17.14,2.07) v1(17.65,102.13) v1(17.65,89.13) v1(17.65,76.13) v1(17.65,63.13) v1(17.65,50.13) v1(17.65,37.13) v1(17.65,24.13) v1(17.65,11.13) v1(18.29,97.17) v1(18.29,84.17) v1(18.29,71.17) v1(18.29,58.17) v1(18.29,45.17) v1(18.29,32.17) v1(18.29,19.17) v1(18.29,6.17) v1(20.22,101.22) v1(20.22,88.22) v1(20.22,75.22) v1(20.22,62.22) v1(20.22,49.22) v1(20.22,36.22) v1(20.22,23.22) v1(20.22,10.22) v1(26.92,58.42) v1(26.92,57.92) v1(26.92,57.42) v1(26.92,45.48) v1(26.92,44.98) v1(26.92,44.48) v1(26.92,33.17) v1(26.92,32.67) v1(26.92,32.17) v1(27.05,101.87) v1(27.05,101.37) v1(27.05,100.87) v1(27.05,97.68) v1(27.05,97.18) v1(27.05,96.68) v1(27.05,89.17) v1(27.05,88.67) v1(27.05,88.17) v1(27.05,71.39) v1(27.05,70.89) v1(27.05,70.39) v1(27.05,62.88) v1(27.05,62.38) v1(27.05,61.88) v1(27.05,49.8) v1(27.05,49.3) v1(27.05,48.8) v1(27.05,35.96) v1(27.05,35.46) v1(27.05,34.96) v1(27.05,20.72) v1(27.05,20.22) v1(27.05,19.72) v1(27.18,83.97) v1(27.18,83.47) v1(27.18,82.97) v1(27.18,76.34) v1(27.18,75.84) v1(27.18,75.34) v1(27.18,38.63) v1(27.18,38.13) v1(27.18,37.63) v1(27.18,23.77) v1(27.18,23.27) v1(27.18,22.77) v1(27.42,58.42) v1(27.42,57.92) v1(27.42,57.42) v1(27.42,45.48) v1(27.42,44.98) v1(27.42,44.48) v1(27.42,33.17) v1(27.42,32.67) v1(27.42,32.17) v1(27.55,101.87) v1(27.55,101.37) v1(27.55,100.87) v1(27.55,97.68) v1(27.55,97.18) v1(27.55,96.68) v1(27.55,89.17) v1(27.55,88.67) v1(27.55,88.17) v1(27.55,71.39) v1(27.55,70.89) v1(27.55,70.39) v1(27.55,62.88) v1(27.55,62.38) v1(27.55,61.88) v1(27.55,49.8) v1(27.55,49.3) v1(27.55,48.8) v1(27.55,35.96) v1(27.55,35.46) v1(27.55,34.96) v1(27.55,20.72) v1(27.55,20.22) v1(27.55,19.72) v1(27.68,83.97) v1(27.68,83.47) v1(27.68,82.97) v1(27.68,76.34) v1(27.68,75.84) v1(27.68,75.34) v1(27.68,38.63) v1(27.68,38.13) v1(27.68,37.63) v1(27.68,23.77) v1(27.68,23.27) v1(27.68,22.77) v1(27.81,2.69) v1(27.81,2.19) v1(27.81,1.69) v1(28.31,2.69) v1(28.31,2.19) v1(28.31,1.69) v1(29.65,102.13) v1(29.65,89.13) v1(29.65,76.13) v1(29.65,63.13) v1(29.65,50.13) v1(29.65,37.13) v1(29.65,24.13) v1(29.65,11.13) v1(30.29,97.17) v1(30.29,84.17) v1(30.29,71.17) v1(30.29,58.17) v1(30.29,45.17) v1(30.29,32.17) v1(30.29,19.17) v1(30.29,6.17) v1(32.22,101.22) v1(32.22,88.22) v1(32.22,75.22) v1(32.22,62.22) v1(32.22,49.22) v1(32.22,36.22) v1(32.22,23.22) v1(32.22,10.22) v1(36.07,2.56) v1(36.07,2.06) v1(36.07,1.56) v1(36.57,2.56) v1(36.57,2.06) v1(36.57,1.56) v1(41.28,28.34) v1(41.28,27.84) v1(41.78,28.34) v1(41.78,27.84) v1(42.28,28.34) v1(42.28,27.84) v1(45.72,85.23) v1(45.72,84.73) v1(46.22,85.23) v1(46.22,84.73) v1(46.23,18.05) v1(46.23,17.55) v1(46.61,25.54) v1(46.61,25.04) v1(46.72,85.23) v1(46.72,84.73) v1(46.73,18.05) v1(46.73,17.55) v1(47.11,25.54) v1(47.11,25.04) v1(47.23,18.05) v1(47.23,17.55) v1(47.61,25.54) v1(47.61,25.04) v1(50.93,84.35) v1(50.93,83.85) v1(51.31,45.99) v1(51.31,45.49) v1(51.43,84.35) v1(51.43,83.85) v1(51.44,12.46) v1(51.44,11.96) v1(51.81,45.99) v1(51.81,45.49) v1(51.82,28.59) v1(51.82,28.09) v1(51.93,84.35) v1(51.93,83.85) v1(51.94,77.36) v1(51.94,76.86) v1(51.94,33.29) v1(51.94,32.79) v1(51.94,12.46) v1(51.94,11.96) v1(52.07,20.21) v1(52.07,19.71) v1(52.2,59.71) v1(52.2,59.21) v1(52.32,51.71) v1(52.32,51.21) v1(52.31,45.99) v1(52.31,45.49) v1(52.32,28.59) v1(52.32,28.09) v1(52.44,77.36) v1(52.44,76.86) v1(52.44,33.29) v1(52.44,32.79) v1(52.44,12.46) v1(52.44,11.96) v1(52.57,20.21) v1(52.57,19.71) v1(52.7,59.71) v1(52.7,59.21) v1(52.82,51.71) v1(52.82,51.21) v1(52.82,28.59) v1(52.82,28.09) v1(52.94,77.36) v1(52.94,76.86) v1(52.94,33.29) v1(52.94,32.79) v1(53.09,71.9) v1(53.09,71.4) v1(53.07,20.21) v1(53.07,19.71) v1(53.2,59.71) v1(53.2,59.21) v1(53.32,51.71) v1(53.32,51.21) v1(53.59,71.9) v1(53.59,71.4) v1(54.09,71.9) v1(54.09,71.4) v2(19.56,92.98) v2(19.56,79.98) v2(19.56,66.98) v2(19.56,53.98) v2(19.56,40.98) v2(19.56,14.98) v2(31.56,92.98) v2(31.56,79.98) v2(31.56,66.98) v2(31.56,53.98) v2(31.56,40.98) v2(31.56,27.98) v2(31.56,14.98)
CAN_H: length 438.6
  Top Layer w0.127: v2(21.97,82.14) 21.97,81.71 21.6,81.34 21.6,81.21 21.79,81.02 21.79,80.68 22.04,80.44 v2(22.04,80.01) 22.04,79.57 21.79,79.33 21.79,79.06 21.63,78.89 21.63,75.96 21.74,75.85 USB5.A7 ; USB9.B7 21.24,47.15 21.35,47.04 21.35,44.98 20.98,44.61 v2(20.98,44.18) ; USB4.A7 33.74,88.85 33.63,88.96 33.63,91.89 33.79,92.06 33.79,92.33 34.04,92.57 v2(34.04,93.01) 34.04,95.08 ; USB12.A7 33.74,36.85 33.63,36.96 33.63,39.89 33.79,40.06 33.79,40.33 34.04,40.57 v2(34.04,41.01) 34.04,43.08 ; v2(20.98,18.18) 20.98,18.61 21.35,18.98 21.35,21.04 21.24,21.15 USB13.B7 ; v2(32.98,83.18) 32.98,83.61 33.35,83.98 33.35,86.04 33.24,86.15 USB4.B7 ; USB14.B7 33.24,21.15 33.35,21.04 33.35,18.98 32.98,18.61 v2(32.98,18.18) ; USB3.B7 21.24,86.15 21.35,86.04 21.35,83.98 20.98,83.61 v2(20.98,83.18) ; USB6.B7 33.24,73.15 33.35,73.04 33.35,70.98 32.98,70.61 v2(32.98,70.18) ; USB6.A7 33.74,75.85 33.63,75.96 33.63,78.89 33.79,79.06 33.79,79.33 34.04,79.57 v2(34.04,80.01) 34.04,82.08 ; USB11.B7 21.24,34.15 21.35,34.04 21.35,31.98 20.98,31.61 v2(20.98,31.18) ; 34.04,69.08 v2(34.04,67.01) 34.04,66.57 33.79,66.33 33.79,66.06 33.63,65.89 33.63,62.96 33.74,62.85 USB8.A7 ; 22.04,17.08 v2(22.04,15.01) 22.04,14.57 21.79,14.33 21.79,14.06 21.63,13.89 21.63,10.96 21.74,10.85 USB15.A7 ; USB3.A7 21.74,88.85 21.63,88.96 21.63,91.89 21.79,92.06 21.79,92.33 22.04,92.57 v2(22.04,93.01) 21.97,93.07 v2(21.97,95.14) ; v2(20.98,57.18) 20.98,57.61 21.35,57.98 21.35,60.04 21.24,60.15 USB7.B7 ; 34.04,17.08 v2(34.04,15.01) 34.04,14.57 33.79,14.33 33.79,14.06 33.63,13.89 33.63,10.96 33.74,10.85 USB16.A7 ; v2(32.98,44.18) 32.98,44.61 33.35,44.98 33.35,47.04 33.24,47.15 USB10.B7 ; v2(32.98,57.18) 32.98,57.61 33.35,57.98 33.35,60.04 33.24,60.15 USB8.B7 ; v2(20.98,96.18) 20.98,96.61 21.35,96.98 21.35,99.04 21.24,99.15 USB1.B7 ; v2(20.98,5.18) 20.98,5.61 21.35,5.98 21.35,8.04 21.24,8.15 USB15.B7 ; USB10.A7 33.74,49.85 33.63,49.96 33.63,52.89 33.79,53.06 33.79,53.33 34.04,53.57 v2(34.04,54.01) 34.04,56.08 ; USB9.A7 21.74,49.85 21.63,49.96 21.63,52.89 21.79,53.06 21.79,53.33 22.04,53.57 v2(22.04,54.01) 22.04,56.08 ; CN2.1 10.69,93.59 10.78,93.5 13.34,93.5 13.59,93.76 13.59,108.85 13.92,109.18 20.9,109.18 21.79,108.29 21.79,106.7 ; USB2.A7 33.74,101.85 33.63,101.96 33.63,104.89 33.79,105.06 33.79,105.33 34.04,105.57 v2(34.04,106.01) 34.04,106.44 33.79,106.68 33.79,108.48 34.3,108.98 40.13,108.98 40.64,108.48 40.64,93.76 40.89,93.5 43.68,93.5 43.92,93.26 44.22,93.26 44.31,93.17 CN3.1 ; USB16.B7 33.24,8.15 33.35,8.04 33.35,5.98 32.98,5.61 v2(32.98,5.18) 32.98,4.75 33.35,4.38 33.35,4.14 33.4,4.09 33.4,1.92 32.54,1.06 24.78,1.06 arc(24.6,1.13) 24.53,1.31 24.53,1.71 arc(24.28,1.96) 24.03,1.71 24.03,1.31 arc(23.78,1.06) 23.53,1.31 23.53,1.64 arc(23.28,1.89) 23.03,1.64 23.03,1.31 arc(22.96,1.13) 22.78,1.06 22.34,1.06 21.6,1.8 21.6,3.33 21.97,3.7 v2(21.97,4.14) ; v2(21.97,69.14) 22.04,69.08 v2(22.04,67.01) 22.04,66.57 21.79,66.33 21.79,66.06 21.63,65.89 21.63,62.96 21.74,62.85 USB7.A7 ; 21.79,106.68 22.04,106.44 v2(22.04,106.01) 22.04,105.57 21.79,105.33 21.79,105.06 21.63,104.89 21.63,101.96 21.74,101.85 USB1.A7 ; USB11.A7 21.74,36.85 21.63,36.96 21.63,39.89 21.79,40.06 21.79,40.33 22.04,40.57 v2(22.04,41.01) 22.04,43.08 ; USB2.B7 33.24,99.15 33.35,99.04 33.35,96.98 32.98,96.61 v2(32.98,96.18) ; USB12.B7 33.24,34.15 33.35,34.04 33.35,31.98 32.98,31.61 v2(32.98,31.18) ; 34.04,30.08 v2(34.04,28.01) 34.04,27.57 33.79,27.33 33.79,27.06 33.63,26.89 33.63,23.96 33.74,23.85 USB14.A7 ; v2(20.98,70.18) 20.98,70.61 21.35,70.98 21.35,73.04 21.24,73.15 USB5.B7 ; 22.04,30.08 v2(22.04,28.01) 22.04,27.57 21.79,27.33 21.79,27.06 21.63,26.89 21.63,23.96 21.74,23.85 USB13.A7
  Inner1 w0.127: v2(21.97,17.14) 21.97,17.19 v2(20.98,18.18) 20.98,26.95 21.49,27.45 21.49,27.45 21.79,27.76 21.79,27.76 v2(22.04,28.01) ; v2(33.97,30.14) 33.97,30.19 v2(32.98,31.18) 32.98,39.95 33.49,40.45 33.49,40.45 33.79,40.76 33.79,40.76 v2(34.04,41.01) ; v2(21.97,69.14) 21.97,69.19 v2(20.98,70.18) 20.98,78.95 21.49,79.45 21.49,79.45 21.79,79.76 21.79,79.76 v2(22.04,80.01) ; v2(22.04,106.01) 21.79,105.76 21.79,105.76 21.49,105.45 21.49,105.45 20.98,104.95 v2(20.98,96.18) 21.97,95.19 v2(21.97,95.14) ; v2(22.04,15.01) 21.79,14.76 21.79,14.76 21.49,14.45 21.49,14.45 20.98,13.95 v2(20.98,5.18) 21.97,4.19 v2(21.97,4.14) ; v2(22.04,93.01) 21.79,92.76 21.79,92.76 21.49,92.45 21.49,92.45 20.98,91.95 v2(20.98,83.18) 21.97,82.19 v2(21.97,82.14) ; v2(33.97,69.14) 33.97,69.19 v2(32.98,70.18) 32.98,78.95 33.49,79.45 33.49,79.45 33.79,79.76 33.79,79.76 v2(34.04,80.01) ; v2(33.97,95.14) 33.97,95.19 v2(32.98,96.18) 32.98,104.95 33.49,105.45 33.49,105.45 33.79,105.76 33.79,105.76 v2(34.04,106.01) ; v2(33.97,56.14) 33.97,56.19 v2(32.98,57.18) 32.98,65.95 33.49,66.45 33.49,66.45 33.79,66.76 33.79,66.76 v2(34.04,67.01) ; v2(33.97,43.14) 33.97,43.19 v2(32.98,44.18) 32.98,52.95 33.49,53.45 33.49,53.45 33.79,53.76 33.79,53.76 v2(34.04,54.01) ; v2(33.97,17.14) 33.97,17.19 v2(32.98,18.18) 32.98,26.95 33.49,27.45 33.49,27.45 33.79,27.76 33.79,27.76 v2(34.04,28.01) ; v2(21.97,43.14) 21.97,43.19 v2(20.98,44.18) 20.98,52.95 21.49,53.45 21.49,53.45 21.79,53.76 21.79,53.76 v2(22.04,54.01) ; v2(21.97,30.14) 21.97,30.19 v2(20.98,31.18) 20.98,39.95 21.49,40.45 21.49,40.45 21.79,40.76 21.79,40.76 v2(22.04,41.01) ; v2(34.04,93.01) 33.79,92.76 33.79,92.76 33.49,92.45 33.49,92.45 32.98,91.95 v2(32.98,83.18) 33.97,82.19 v2(33.97,82.14) ; v2(22.04,67.01) 21.79,66.76 21.79,66.76 21.49,66.45 21.49,66.45 20.98,65.95 v2(20.98,57.18) 21.97,56.19 v2(21.97,56.14) ; v2(32.98,5.18) 32.98,13.95 33.49,14.45 33.49,14.45 33.79,14.76 33.79,14.76 v2(34.04,15.01)
CAN_L: length 438.6
  Top Layer w0.127: v2(22,31.18) 22,31.61 21.63,31.98 21.63,34.04 21.74,34.15 USB11.B6 ; USB1.A6 21.24,101.85 21.35,101.96 21.35,105.01 21.52,105.17 21.52,105.3 21.27,105.54 v2(21.27,105.97) 21.27,106.25 21.52,106.5 21.52,108.04 20.66,108.9 14.27,108.9 13.97,108.6 13.97,93.62 13.58,93.22 10.78,93.22 10.67,93.11 10.67,90.84 CN2.2 ; v2(34,18.18) 34,18.61 33.63,18.98 33.63,21.04 33.74,21.15 USB14.B6 ; v2(20.96,4.14) 20.96,3.71 21.32,3.34 21.32,1.68 22.22,0.78 32.65,0.78 33.68,1.81 33.68,4.21 33.63,4.25 33.63,4.38 34,4.75 v2(34,5.18) 34,5.61 33.63,5.98 33.63,8.04 33.74,8.15 USB16.B6 ; USB3.B6 21.74,86.15 21.63,86.04 21.63,83.98 22,83.61 v2(22,83.18) ; v2(20.96,56.14) 20.96,54.29 v2(21.27,53.97) 21.27,53.54 21.52,53.3 21.52,53.17 21.35,53.01 21.35,49.96 21.24,49.85 21.24,49.37 ; 21.32,62.45 21.24,62.37 ; 21.24,62.37 21.24,62.85 21.35,62.96 21.35,66.01 21.52,66.17 21.52,66.3 21.27,66.54 v2(21.27,66.97) 20.96,67.29 v2(20.96,69.14) ; 21.24,62.37 USB7.A6 ; v2(22,5.18) 22,5.61 21.63,5.98 21.63,8.04 21.74,8.15 USB15.B6 ; 33.24,101.37 USB2.A6 ; 33.24,101.37 33.24,101.85 33.35,101.96 33.35,105.01 33.52,105.17 33.52,105.3 33.27,105.54 v2(33.27,105.97) 33.27,106.41 33.52,106.65 33.52,108.59 34.19,109.26 40.25,109.26 40.92,108.59 40.92,93.87 41.01,93.78 43.79,93.78 44.03,93.54 44.22,93.54 44.31,93.63 CN3.2 ; 33.24,101.37 33.32,101.45 ; 21.24,10.37 USB15.A6 ; 21.24,10.37 21.32,10.45 ; 21.24,10.37 21.24,10.85 21.35,10.96 21.35,14.01 21.52,14.18 21.52,14.3 21.27,14.54 v2(21.27,14.97) 20.96,15.29 v2(20.96,17.14) ; 33.32,36.45 33.24,36.37 ; 33.24,36.37 USB12.A6 ; 33.24,36.37 33.24,36.85 33.35,36.96 33.35,40.01 33.52,40.17 33.52,40.3 33.27,40.54 v2(33.27,40.97) 32.96,41.29 v2(32.96,43.14) ; v2(22,96.18) 22,96.61 21.63,96.98 21.63,99.04 21.74,99.15 USB1.B6 ; USB10.B6 33.74,47.15 33.63,47.04 33.63,44.98 34,44.61 v2(34,44.18) ; v2(32.96,30.14) 32.96,28.29 v2(33.27,27.97) 33.27,27.54 33.52,27.3 33.52,27.18 33.35,27.01 33.35,23.96 33.24,23.85 33.24,23.37 ; 33.32,49.45 33.24,49.37 ; 33.24,49.37 33.24,49.85 33.35,49.96 33.35,53.01 33.52,53.17 33.52,53.3 33.27,53.54 v2(33.27,53.97) 32.96,54.29 v2(32.96,56.14) ; 33.24,49.37 USB10.A6 ; v2(20.96,43.14) 20.96,41.29 v2(21.27,40.97) 21.27,40.54 21.52,40.3 21.52,40.17 21.35,40.01 21.35,36.96 21.24,36.85 21.24,36.37 ; 21.24,75.37 21.24,75.85 21.35,75.96 21.35,79.01 21.52,79.17 21.52,79.3 21.27,79.54 v2(21.27,79.97) 21.27,80.41 21.52,80.65 21.52,80.91 21.32,81.1 21.32,81.34 20.96,81.71 v2(20.96,82.14) ; 21.24,75.37 21.32,75.45 ; 21.24,75.37 USB5.A6 ; 33.32,88.45 33.24,88.37 ; 33.24,88.37 33.24,88.85 33.35,88.96 33.35,92.01 33.52,92.17 33.52,92.3 33.27,92.54 v2(33.27,92.97) 32.96,93.29 v2(32.96,95.14) ; 33.24,88.37 USB4.A6 ; USB2.B6 33.74,99.15 33.63,99.04 33.63,96.98 34,96.61 v2(34,96.18) ; 21.24,23.37 USB13.A6 ; 21.24,23.37 21.24,23.85 21.35,23.96 21.35,27.01 21.52,27.18 21.52,27.3 21.27,27.54 v2(21.27,27.97) 20.96,28.29 v2(20.96,30.14) ; 21.24,23.37 21.32,23.45 ; 21.32,49.45 21.24,49.37 ; 21.24,49.37 USB9.A6 ; USB7.B6 21.74,60.15 21.63,60.04 21.63,57.98 22,57.61 v2(22,57.18) ; 33.24,75.37 33.24,75.85 33.35,75.96 33.35,79.01 33.52,79.17 33.52,79.3 33.27,79.54 v2(33.27,79.97) 32.96,80.29 v2(32.96,82.14) ; 33.24,75.37 USB6.A6 ; 33.24,75.37 33.32,75.45 ; 21.32,36.45 21.24,36.37 ; 21.24,36.37 USB11.A6 ; USB12.B6 33.74,34.15 33.63,34.04 33.63,31.98 34,31.61 v2(34,31.18) ; 33.24,23.37 USB14.A6 ; 33.24,23.37 33.32,23.45 ; 33.32,62.45 33.24,62.37 ; 33.24,62.37 33.24,62.85 33.35,62.96 33.35,66.01 33.52,66.17 33.52,66.3 33.27,66.54 v2(33.27,66.97) 32.96,67.29 v2(32.96,69.14) ; 33.24,62.37 USB8.A6 ; v2(20.96,95.14) 20.96,93.29 v2(21.27,92.97) 21.27,92.54 21.52,92.3 21.52,92.17 21.35,92.01 21.35,88.96 21.24,88.85 21.24,88.37 ; 21.24,88.37 USB3.A6 ; 21.24,88.37 21.32,88.45 ; v2(22,70.18) 22,70.61 21.63,70.98 21.63,73.04 21.74,73.15 USB5.B6 ; v2(22,44.18) 22,44.61 21.63,44.98 21.63,47.04 21.74,47.15 USB9.B6 ; v2(34,57.18) 34,57.61 33.63,57.98 33.63,60.04 33.74,60.15 USB8.B6 ; USB4.B6 33.74,86.15 33.63,86.04 33.63,83.98 34,83.61 v2(34,83.18) ; USB6.B6 33.74,73.15 33.63,73.04 33.63,70.98 34,70.61 v2(34,70.18) ; 33.32,10.45 33.24,10.37 ; 33.24,10.37 USB16.A6 ; 33.24,10.37 33.24,10.85 33.35,10.96 33.35,14.01 33.52,14.18 33.52,14.3 33.27,14.54 v2(33.27,14.97) 32.96,15.29 v2(32.96,17.14) ; USB13.B6 21.74,21.15 21.63,21.04 21.63,18.98 22,18.61 v2(22,18.18)
  Inner2 w0.127: v2(33.27,53.97) 34,53.25 v2(34,44.18) 32.96,43.14 v2(32.96,43.14) ; v2(33.27,27.97) 34,27.25 v2(34,18.18) 32.96,17.14 v2(32.96,17.14) ; v2(20.96,69.14) 20.96,69.14 v2(22,70.18) 22,79.25 v2(21.27,79.97) ; v2(20.96,43.14) 20.96,43.14 v2(22,44.18) 22,53.25 v2(21.27,53.97) ; v2(21.27,66.97) 22,66.25 v2(22,57.18) 20.96,56.14 v2(20.96,56.14) ; v2(21.27,92.97) 22,92.25 v2(22,83.18) 20.96,82.14 v2(20.96,82.14) ; v2(20.96,30.14) 20.96,30.14 v2(22,31.18) 22,40.25 v2(21.27,40.97) ; v2(33.27,66.97) 34,66.25 v2(34,57.18) 32.96,56.14 v2(32.96,56.14) ; v2(20.96,95.14) 20.96,95.14 v2(22,96.18) 22,105.25 v2(21.27,105.97) ; v2(33.27,79.97) 34,79.25 v2(34,70.18) 32.96,69.14 v2(32.96,69.14) ; v2(33.27,105.97) 34,105.25 v2(34,96.18) 32.96,95.14 v2(32.96,95.14) ; v2(20.96,17.14) 20.96,17.14 v2(22,18.18) 22,27.25 v2(21.27,27.97) ; v2(33.27,14.97) 34,14.25 v2(34,5.18) ; v2(33.27,92.97) 34,92.25 v2(34,83.18) 32.96,82.14 v2(32.96,82.14) ; v2(33.27,40.97) 34,40.25 v2(34,31.18) 32.96,30.14 v2(32.96,30.14) ; v2(20.96,4.14) 20.96,4.14 v2(22,5.18) 22,14.25 v2(21.27,14.97)
CLK: length 279.4
  Top Layer w0.127: v2(23.11,18.28) 22.24,19.16 USB13.B5 22.24,22.24 21.97,22.51 20.83,22.51 20.74,22.6 USB13.A5 20.83,23.34 20.83,27.43 v2(20.32,27.94) ; v2(20.32,79.94) 20.83,79.43 20.83,75.34 USB5.A5 20.74,74.6 20.83,74.51 21.97,74.51 22.24,74.24 USB5.B5 22.24,71.16 v2(23.11,70.28) ; v2(20.32,40.94) 20.83,40.43 20.83,36.34 USB11.A5 20.74,35.6 20.83,35.51 21.97,35.51 22.24,35.24 USB11.B5 22.24,32.16 v2(23.11,31.28) ; v2(35.11,18.28) 34.24,19.16 USB14.B5 34.24,22.24 33.97,22.51 32.83,22.51 32.74,22.6 USB14.A5 32.83,23.34 32.83,27.43 v2(32.32,27.94) ; v2(35.11,83.28) 34.24,84.16 USB4.B5 34.24,87.24 33.97,87.51 32.83,87.51 32.74,87.6 USB4.A5 32.83,88.34 32.83,92.43 v2(32.32,92.94) ; v2(23.11,44.28) 22.24,45.16 USB9.B5 22.24,48.24 21.97,48.51 20.83,48.51 20.74,48.6 USB9.A5 20.83,49.34 20.83,53.43 v2(20.32,53.94) ; v2(20.32,105.94) 20.83,105.43 20.83,101.34 USB1.A5 20.74,100.6 20.83,100.51 21.97,100.51 22.24,100.24 USB1.B5 22.24,97.16 v2(23.11,96.28) ; v2(32.32,14.94) 32.83,14.43 32.83,10.34 USB16.A5 32.74,9.6 32.83,9.51 33.97,9.51 34.24,9.24 USB16.B5 34.24,6.16 v2(35.11,5.28) ; v2(32.32,40.94) 32.83,40.43 32.83,36.34 USB12.A5 32.74,35.6 32.83,35.51 33.97,35.51 34.24,35.24 USB12.B5 34.24,32.16 v2(35.11,31.28) ; v2(35.11,96.28) 34.24,97.16 USB2.B5 34.24,100.24 33.97,100.51 32.83,100.51 32.74,100.6 USB2.A5 32.83,101.34 32.83,105.43 v2(32.32,105.94) ; v2(23.11,5.28) 22.24,6.16 USB15.B5 22.24,9.24 21.97,9.51 20.83,9.51 20.74,9.6 USB15.A5 20.83,10.34 20.83,14.43 v2(20.32,14.94) ; v2(20.32,66.94) 20.83,66.43 20.83,62.34 USB7.A5 20.74,61.6 20.83,61.51 21.97,61.51 22.24,61.24 USB7.B5 22.24,58.16 v2(23.11,57.28) ; v2(32.32,66.94) 32.83,66.43 32.83,62.34 USB8.A5 32.74,61.6 32.83,61.51 33.97,61.51 34.24,61.24 USB8.B5 34.24,58.16 v2(35.11,57.28) ; v2(32.32,79.94) 32.83,79.43 32.83,75.34 USB6.A5 32.74,74.6 32.83,74.51 33.97,74.51 34.24,74.24 USB6.B5 34.24,71.16 v2(35.11,70.28) ; v2(35.11,44.28) 34.24,45.16 USB10.B5 34.24,48.24 33.97,48.51 32.83,48.51 32.74,48.6 USB10.A5 32.83,49.34 32.83,53.43 v2(32.32,53.94) ; v2(20.32,92.94) 20.83,92.43 20.83,88.34 USB3.A5 20.74,87.6 20.83,87.51 21.97,87.51 22.24,87.24 USB3.B5 22.24,84.16 v2(23.11,83.28)
  Inner1 w0.127: v2(23.11,5.28) 24.57,3.83 34.54,3.83 35.11,4.4 v2(35.11,5.28)
  Inner2 w0.127: v2(35.11,31.28) 35.11,29.6 34.99,29.47 32.7,29.47 32.32,29.09 v2(32.32,27.94) ; v2(32.32,66.94) 32.32,68.09 32.7,68.47 34.99,68.47 35.11,68.6 v2(35.11,70.28) ; v2(32.32,40.94) 32.32,42.09 32.7,42.47 34.99,42.47 35.11,42.6 v2(35.11,44.28) ; v2(20.32,92.94) 20.32,93.49 21.21,94.38 22.73,94.38 23.11,94.76 v2(23.11,96.28) ; v2(32.32,79.94) 32.32,81.09 32.7,81.47 34.99,81.47 35.11,81.6 v2(35.11,83.28) ; v2(20.32,79.94) 20.32,80.49 21.13,81.3 22.48,81.3 23.11,81.93 v2(23.11,83.28) ; v2(23.11,31.28) 23.11,29.6 22.99,29.47 20.7,29.47 20.32,29.09 v2(20.32,27.94) ; v2(20.32,53.94) 20.32,55.09 20.7,55.47 22.99,55.47 23.11,55.6 v2(23.11,57.28) ; v2(35.11,57.28) 35.11,55.6 34.99,55.47 32.7,55.47 32.32,55.09 v2(32.32,53.94) ; v2(32.32,92.94) 32.32,94.09 32.7,94.47 34.99,94.47 35.11,94.6 v2(35.11,96.28) ; v2(23.11,70.28) 23.11,68.6 22.99,68.47 20.7,68.47 20.32,68.09 v2(20.32,66.94) ; v2(20.32,14.94) 20.32,16.09 20.7,16.47 22.99,16.47 23.11,16.6 v2(23.11,18.28) ; v2(23.11,44.28) 23.11,42.6 22.99,42.47 20.7,42.47 20.32,42.09 v2(20.32,40.94) ; v2(35.11,18.28) 35.11,16.6 34.99,16.47 32.7,16.47 32.32,16.09 v2(32.32,14.94)
LED1: length 13.8
  Inner1 w0.127: v1(17.78,105.56) 16.95,104.73 16.95,100.54 17.2,100.29 17.2,100.28 17.51,99.96 17.53,99.96 17.74,99.75 v1(19.24,99.75)
  Bottom Layer w0.127: v1(23.74,101.25) 23.74,100.72 23.62,100.6 19.43,100.6 19.3,100.47 19.3,99.81 v1(19.24,99.75)
LED2: length 13.8
  Inner1 w0.127: v1(29.78,105.56) 28.95,104.73 28.95,100.54 29.2,100.29 29.2,100.28 29.51,99.96 29.53,99.96 29.74,99.75 v1(31.24,99.75)
  Bottom Layer w0.127: v1(35.74,101.25) 35.74,100.72 35.62,100.6 31.43,100.6 31.3,100.47 31.3,99.81 v1(31.24,99.75)
LED3: length 13.8
  Inner1 w0.127: v1(17.78,92.56) 16.95,91.73 16.95,87.54 17.2,87.29 17.2,87.28 17.51,86.96 17.53,86.96 17.74,86.75 v1(19.24,86.75)
  Bottom Layer w0.127: v1(19.24,86.75) 19.3,86.81 19.3,87.47 19.43,87.6 23.62,87.6 23.74,87.72 v1(23.74,88.25)
LED4: length 13.8
  Inner1 w0.127: v1(29.78,92.56) 28.95,91.73 28.95,87.54 29.2,87.29 29.2,87.28 29.51,86.96 29.53,86.96 29.74,86.75 v1(31.24,86.75)
  Bottom Layer w0.127: v1(35.74,88.25) 35.74,87.72 35.62,87.6 31.43,87.6 31.3,87.47 31.3,86.81 v1(31.24,86.75)
LED5: length 13.8
  Inner1 w0.127: v1(19.24,73.75) 17.74,73.75 17.53,73.96 17.51,73.96 17.2,74.28 17.2,74.29 16.95,74.54 16.95,78.73 v1(17.78,79.56)
  Bottom Layer w0.127: v1(23.74,75.25) 23.74,74.72 23.62,74.6 19.43,74.6 19.3,74.47 19.3,73.81 v1(19.24,73.75)
LED6: length 13.8
  Inner1 w0.127: v1(29.78,79.56) 28.95,78.73 28.95,74.54 29.2,74.29 29.2,74.28 29.51,73.96 29.53,73.96 29.74,73.75 v1(31.24,73.75)
  Bottom Layer w0.127: v1(31.24,73.75) 31.3,73.81 31.3,74.47 31.43,74.6 35.62,74.6 35.74,74.72 v1(35.74,75.25)
LED7: length 13.8
  Inner1 w0.127: v1(17.78,66.56) 16.95,65.73 16.95,61.54 17.2,61.29 17.2,61.28 17.51,60.96 17.53,60.96 17.74,60.75 v1(19.24,60.75)
  Bottom Layer w0.127: v1(23.74,62.25) 23.74,61.72 23.62,61.6 19.43,61.6 19.3,61.47 19.3,60.81 v1(19.24,60.75)
LED8: length 13.8
  Inner1 w0.127: v1(29.78,66.56) 28.95,65.73 28.95,61.54 29.2,61.29 29.2,61.28 29.51,60.96 29.53,60.96 29.74,60.75 v1(31.24,60.75)
  Bottom Layer w0.127: v1(35.74,62.25) 35.74,61.72 35.62,61.6 31.43,61.6 31.3,61.47 31.3,60.81 v1(31.24,60.75)
LED9: length 13.8
  Inner1 w0.127: v1(19.24,47.75) 17.74,47.75 17.53,47.96 17.51,47.96 17.2,48.28 17.2,48.29 16.95,48.54 16.95,52.73 v1(17.78,53.56)
  Bottom Layer w0.127: v1(19.24,47.75) 19.3,47.81 19.3,48.47 19.43,48.6 23.62,48.6 23.74,48.72 v1(23.74,49.25)
LED10: length 13.8
  Inner1 w0.127: v1(31.24,47.75) 29.74,47.75 29.53,47.96 29.51,47.96 29.2,48.28 29.2,48.29 28.95,48.54 28.95,52.73 v1(29.78,53.56)
  Bottom Layer w0.127: v1(35.74,49.25) 35.74,48.72 35.62,48.6 31.43,48.6 31.3,48.47 31.3,47.81 v1(31.24,47.75)
LED11: length 13.8
  Inner1 w0.127: v1(17.78,40.56) 16.95,39.73 16.95,35.54 17.2,35.29 17.2,35.28 17.51,34.96 17.53,34.96 17.74,34.75 v1(19.24,34.75)
  Bottom Layer w0.127: v1(19.24,34.75) 19.3,34.81 19.3,35.47 19.43,35.6 23.62,35.6 23.74,35.72 v1(23.74,36.25)
LED12: length 13.8
  Inner1 w0.127: v1(31.24,34.75) 29.74,34.75 29.53,34.96 29.51,34.96 29.2,35.28 29.2,35.29 28.95,35.54 28.95,39.73 v1(29.78,40.56)
  Bottom Layer w0.127: v1(35.74,36.25) 35.74,35.72 35.62,35.6 31.43,35.6 31.3,35.47 31.3,34.81 v1(31.24,34.75)
LED13: length 13.8
  Inner1 w0.127: v1(17.78,27.56) 16.95,26.73 16.95,22.54 17.2,22.29 17.2,22.28 17.51,21.96 17.53,21.96 17.74,21.75 v1(19.24,21.75)
  Bottom Layer w0.127: v1(19.24,21.75) 19.3,21.81 19.3,22.47 19.43,22.6 23.62,22.6 23.74,22.72 v1(23.74,23.25)
LED14: length 13.8
  Inner1 w0.127: v1(29.78,27.56) 28.95,26.73 28.95,22.54 29.2,22.29 29.2,22.28 29.51,21.96 29.53,21.96 29.74,21.75 v1(31.24,21.75)
  Bottom Layer w0.127: v1(35.74,23.25) 35.74,22.72 35.62,22.6 31.43,22.6 31.3,22.47 31.3,21.81 v1(31.24,21.75)
